# Altium schematic sheet PowerDomains.SchDoc
size A4
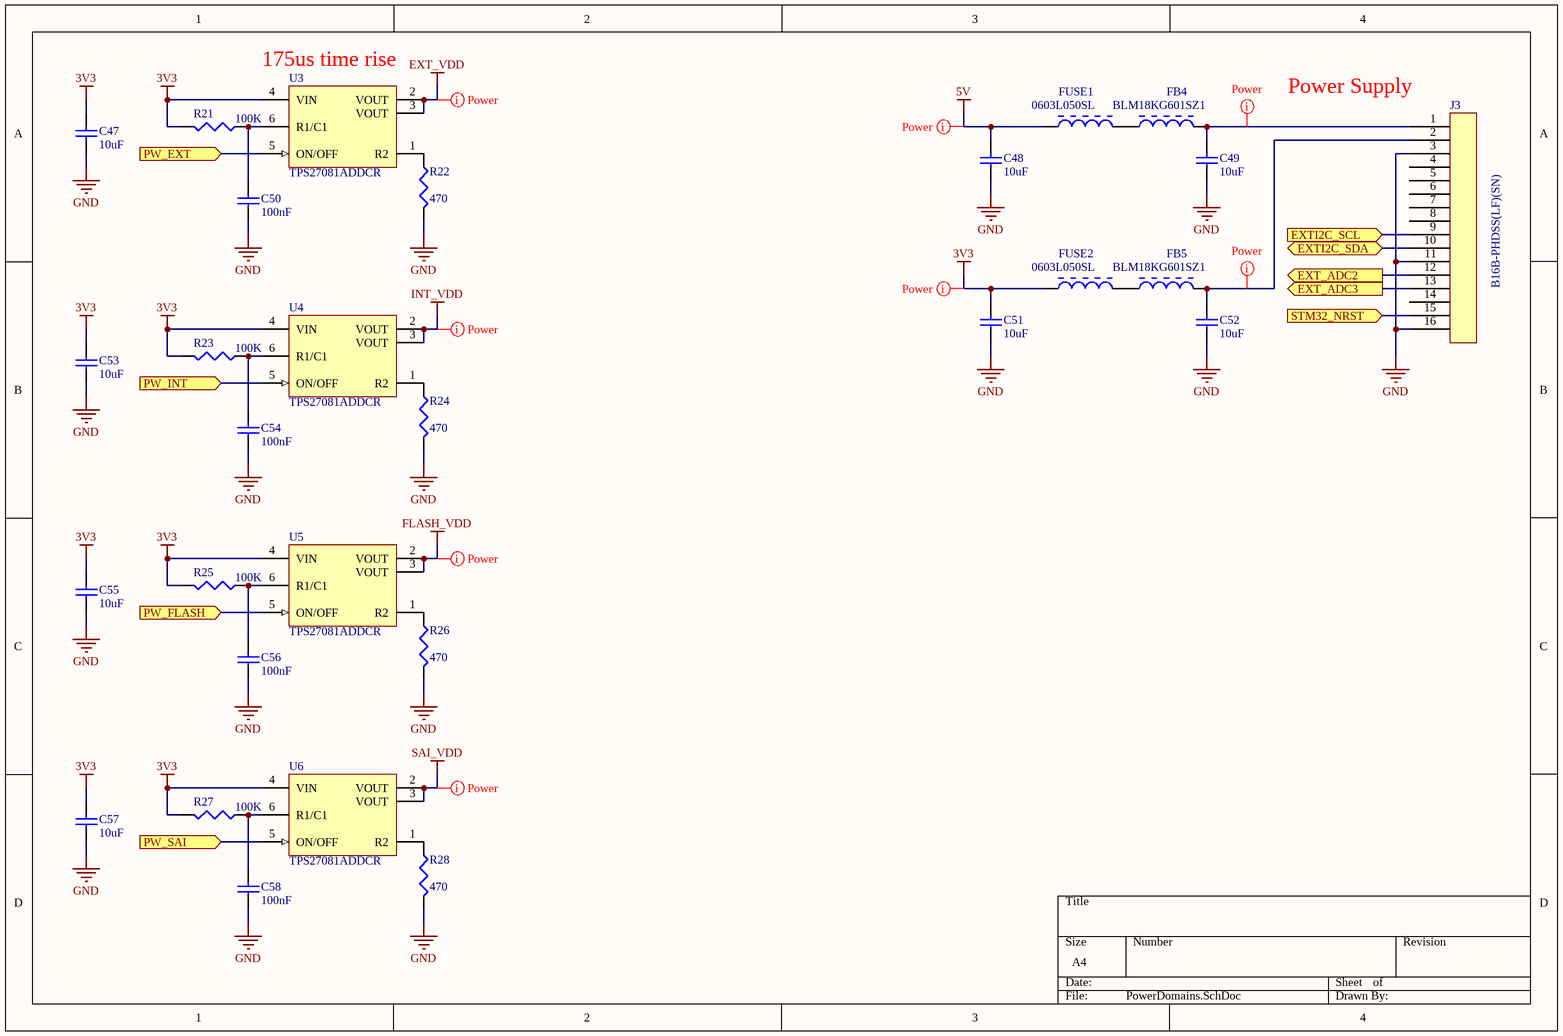
[diagram p0: PowerDomains.SchDoc]

## Parts
C47  10uF  [CAPC1608X90X35NL10T15]
C48  10uF  [CAPC1608X90X35NL10T15]
C49  10uF  [CAPC1608X90X35NL10T15]
C50  100nF  [CAPC1608X90X35NL10T15]
C51  10uF  [CAPC1608X90X35NL10T15]
C52  10uF  [CAPC1608X90X35NL10T15]
C53  10uF  [CAPC1608X90X35NL10T15]
C54  100nF  [CAPC1608X90X35NL10T15]
C55  10uF  [CAPC1608X90X35NL10T15]
C56  100nF  [CAPC1608X90X35NL10T15]
C57  10uF  [CAPC1608X90X35NL10T15]
C58  100nF  [CAPC1608X90X35NL10T15]
FB4  BLM18KG601SZ1  [MURA-BLM18SG-B25-CHIP-2_V1]
FB5  BLM18KG601SZ1  [MURA-BLM18SG-B25-CHIP-2_V1]
FUSE1  0603L050SL  [MURA-BLM18SG-B25-CHIP-2_V1]
FUSE2  0603L050SL  [MURA-BLM18SG-B25-CHIP-2_V1]
J3  B16B-PHDSS(LF)(SN)  [B16B-PHDSS(LF)(SN) - duplicate]
R21  value 100K  [J1-0603]
R22  value 470  [J1-0603]
R23  value 100K  [J1-0603]
R24  value 470  [J1-0603]
R25  value 100K  [J1-0603]
R26  value 470  [J1-0603]
R27  value 100K  [J1-0603]
R28  value 470  [J1-0603]
U3  TPS27081ADDCR  [DDC0006A_L]
U4  TPS27081ADDCR  [DDC0006A_L]
U5  TPS27081ADDCR  [DDC0006A_L]
U6  TPS27081ADDCR  [DDC0006A_L]

## Ports
EXT_ADC2 (out), EXT_ADC3 (out), EXTI2C_SCL (in), EXTI2C_SDA (bidir), PW_EXT (in), PW_FLASH (in), PW_INT (in), PW_SAI (in), STM32_NRST (in)

## Nets
3V3: C47.2 C51.2 C53.2 C55.2 C57.2 FUSE2.1 R21.2 R23.2 R25.2 R27.2 U3.4(VIN) U4.4(VIN) U5.4(VIN) U6.4(VIN)
5V: C48.2 FUSE1.1
EXT_VDD: U3.2(VOUT) U3.3(VOUT)
FLASH_VDD: U5.2(VOUT) U5.3(VOUT)
GND: C47.1 C48.1 C49.1 C50.1 C51.1 C52.1 C53.1 C54.1 C55.1 C56.1 C57.1 C58.1 J3.3 J3.11 J3.16 R22.2 R24.2 R26.2 R28.2
INT_VDD: U4.2(VOUT) U4.3(VOUT)
SAI_VDD: U6.2(VOUT) U6.3(VOUT)
EXT_ADC2: J3.12 ; port EXT_ADC2
EXT_ADC3: J3.13 ; port EXT_ADC3
EXTI2C_SCL: J3.9 ; port EXTI2C_SCL
EXTI2C_SDA: J3.10 ; port EXTI2C_SDA
PW_EXT: U3.5(ON/OFF) ; port PW_EXT
PW_FLASH: U5.5(ON/OFF) ; port PW_FLASH
PW_INT: U4.5(ON/OFF) ; port PW_INT
PW_SAI: U6.5(ON/OFF) ; port PW_SAI
STM32_NRST: J3.15 ; port STM32_NRST
NetC49_2: C49.2 FB4.2 J3.1
NetC50_2: C50.2 R21.1 U3.6(R1/C1)
NetC52_2: C52.2 FB5.2 J3.2
NetC54_2: C54.2 R23.1 U4.6(R1/C1)
NetC56_2: C56.2 R25.1 U5.6(R1/C1)
NetC58_2: C58.2 R27.1 U6.6(R1/C1)
NetFB4_1: FB4.1 FUSE1.2
NetFB5_1: FB5.1 FUSE2.2
NetR22_1: R22.1 U3.1(R2)
NetR24_1: R24.1 U4.1(R2)
NetR26_1: R26.1 U5.1(R2)
NetR28_1: R28.1 U6.1(R2)

Not connected (* = marked no-connect by the designer): J3 4 5 6 7 8 14

## Layout directives
rule Width Constraint [Pref Width = 0.4mm    Min Width = 0.3mm    Max Width = 0.6mm]; rule Routing Via Style [Pref Size = 0.5mm    Pref Hole Size = 0.3mm]: 3V3, 5V, EXT_VDD, FLASH_VDD, INT_VDD, NetC49_2, NetC52_2, SAI_VDD

## Notes on the sheet
- (near U3) 175us time rise
- (near J3) Power Supply

## Library data of the parts
C47-C58 = CMP-2006-02891-1: Part Number: GRM188R71H102KA01D; Manufacturer: Murata
FB4 FB5 FUSE1 FUSE2 = CMP-0686-00596-2: Chip Ferrite Bead for Power Lines (Low DC Resistance Type), 220 Ohm, 2500 mA, -55 to 125 degC, 1.6 x 0.8 x 0.65 mm SMD, Tape and Reel; Manufacturer: Murata; PartNumber: BLM18SG221TN1D; Impedance (at 100 MHz): 220 Ohm +/- 25%; DC Resistance: 0.040 Ohm Max.; Rated Current: 2500 mA; ComponentLink2Description: Datasheet; ComponentLink1Description: Manufacturer URL; ComponentLink3Description: Package Specification; DatasheetVersion: 08/2013; Packing: Tape and Reel; PackageReference: BLM18_H650-2; PackageDescription: 2-Pin Chip, Body 1.6 x 0.8 mm; Mounting Technology: Surface Mount; Operating Temperature Range: -55 to 125 degC; ComponentLink1URL: http://www.murata.com/; ComponentLink2URL: http://www.murata.com/products/catalog/pdf/c31e.pdf; ComponentLink3URL: http://www.murata.com/products/catalog/pdf/c31e.pdf
R21-R28 = Res3: Resistor; Published: 8-Jun-2000; LatestRevisionDate: 29-May-2009; LatestRevisionNote: IPC-7351 Footprint Added.; PackageReference: J1-0603; Publisher: Altium Limited; PackageDescription: Chip Resistor
U3-U6 = CMP-2000-07278-1: PFET High-Side Load Switch with Level Shift and Adjustable Slew Rate Control, 1 to 8 V, 3 A, -40 to 85 degC, 6-Pin SOT (DDC), Green (RoHS & no Sb/Br), Tape and Reel; Manufacturer Product Page: TPS27081ADDCRSpecifications; Manufacturer: Texas Instruments; VIN Max: 8V; Power Dissipation Max: 1190mW; Interface: On/Off; Voltage - Load: 1.2V~8V; Rds On (Typ): 32mOhm; Voltage - Supply (Vcc/Vdd): NotRequired; EDA / CAD Models: DownloadfromAcceleratedDesigns; Ratio - Input: Output:1:1; Online Catalog: GeneralPurpose; VIN Min: 1V; Number of Outputs: 1; Output Configuration: HighSide; Package Version: 4204403-3/E, 06/2005; Current - Output (Max): 3A; Other Names: 296-34970-6; Manufacturer URL: http://www.ti.com/; Category: IntegratedCircuits(ICs); Standard Package: 1; Features: SlewRateControlled; Operating Temperature: -40°C~85°C(TA); Datasheet Version: Rev. E, 06/2015; PartNumber: TPS27081A; Package Reference: DDC6; Mounting Technology: SurfaceMount; Package URL: http://www.ti.com/litv/pdf/mpds124d; Package / Case: SOT-23-6Thin,TSOT-23-6; Family: PMIC-PowerDistributionSwitches,LoadDrivers; Supplier Device Package: 6-SOT; Datasheet URL: http://www.ti.com/lit/ds/symlink/tps27081a.pdf; Packaging: Digi-Reel®; Switch Type: GeneralPurpose; Package Description: 6-Pin Small Outline Transistor, Body 2.9 x 1.6 mm, Pitch 0.95 mm